# EAGLE schematic ManualBotLower (EAGLE 8.5.2)
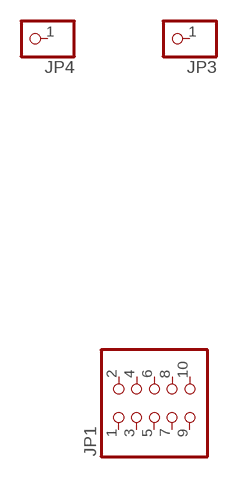
[diagram p0: schematic, sheet 1]

## Parts
JP1  PINHD-2X5  [2X05]
JP3  PINHD-1X1  [1X01]
JP4  PINHD-1X1  [1X01]
Unconnected: JP1.1 JP1.2 JP1.3 JP1.4 JP1.5 JP1.6 JP1.7 JP1.8 JP1.9 JP1.10 JP3.1 JP4.1

## Library data of the parts
JP1 = pinhead:PINHD-2X5: PIN HEADER
JP3 JP4 = pinhead:PINHD-1X1: PIN HEADER